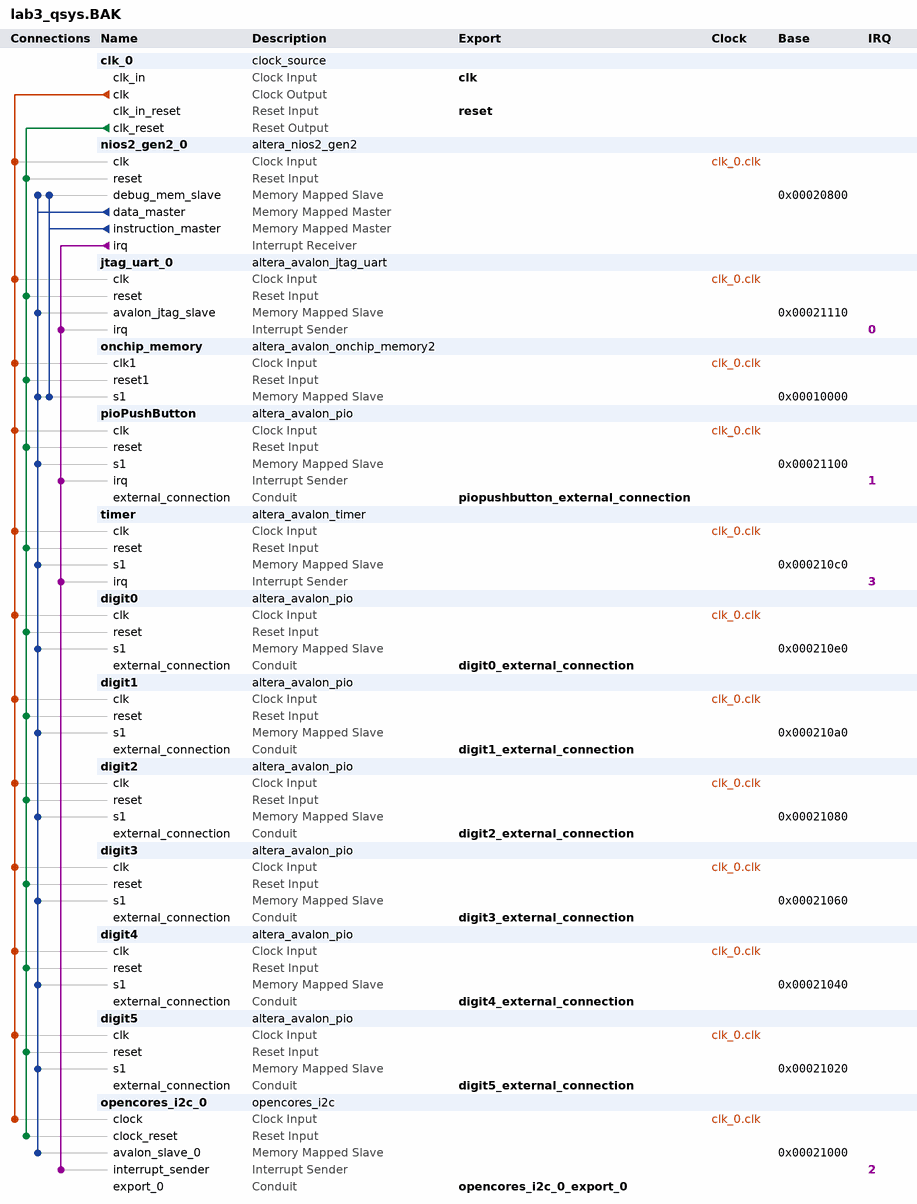
[diagram p0: system contents]
# Platform Designer (Qsys) system lab3_qsys.BAK, MAX 10 10M50DAF484C7G
# Parameters at their usual value, and those the tool derives, are not listed.
package require -exact qsys 18.0
create_system lab3_qsys.BAK
set_project_property DEVICE_FAMILY {MAX 10}
set_project_property DEVICE 10M50DAF484C7G

add_instance clk_0 clock_source 18.0
set_instance_parameter_value clk_0 clockFrequency 50000000

add_instance nios2_gen2_0 altera_nios2_gen2 18.0
set_instance_parameter_value nios2_gen2_0 dcache_size 2048
set_instance_parameter_value nios2_gen2_0 exceptionSlave onchip_memory.s1
set_instance_parameter_value nios2_gen2_0 icache_size 4096
set_instance_parameter_value nios2_gen2_0 impl Tiny
set_instance_parameter_value nios2_gen2_0 resetSlave onchip_memory.s1

add_instance jtag_uart_0 altera_avalon_jtag_uart 18.0
set_instance_parameter_value jtag_uart_0 simInteractiveOptions NO_INTERACTIVE_WINDOWS

add_instance onchip_memory altera_avalon_onchip_memory2 18.0
set_instance_parameter_value onchip_memory dataWidth 32
set_instance_parameter_value onchip_memory dualPort false
set_instance_parameter_value onchip_memory initMemContent false
set_instance_parameter_value onchip_memory initializationFileName {C:/Users/User/Documents/Conception conjointe/FAUGERE_Lab1/software/app/mem_init/lab1_qsys_onchip_memory.hex}
set_instance_parameter_value onchip_memory memorySize 40000

add_instance pioPushButton altera_avalon_pio 18.0
set_instance_parameter_value pioPushButton bitClearingEdgeCapReg true
set_instance_parameter_value pioPushButton captureEdge true
set_instance_parameter_value pioPushButton direction Input
set_instance_parameter_value pioPushButton edgeType FALLING
set_instance_parameter_value pioPushButton generateIRQ true
set_instance_parameter_value pioPushButton irqType EDGE
set_instance_parameter_value pioPushButton width 1

add_instance timer altera_avalon_timer 18.0
set_instance_parameter_value timer period 100
set_instance_parameter_value timer periodUnits MSEC

add_instance digit0 altera_avalon_pio 18.0
set_instance_parameter_value digit0 bitModifyingOutReg true
set_instance_parameter_value digit0 direction Output
set_instance_parameter_value digit0 width 4

add_instance digit1 altera_avalon_pio 18.0
set_instance_parameter_value digit1 bitModifyingOutReg true
set_instance_parameter_value digit1 direction Output
set_instance_parameter_value digit1 width 4

add_instance digit2 altera_avalon_pio 18.0
set_instance_parameter_value digit2 bitModifyingOutReg true
set_instance_parameter_value digit2 direction Output
set_instance_parameter_value digit2 width 4

add_instance digit3 altera_avalon_pio 18.0
set_instance_parameter_value digit3 bitModifyingOutReg true
set_instance_parameter_value digit3 direction Output
set_instance_parameter_value digit3 width 4

add_instance digit4 altera_avalon_pio 18.0
set_instance_parameter_value digit4 bitModifyingOutReg true
set_instance_parameter_value digit4 direction Output
set_instance_parameter_value digit4 width 4

add_instance digit5 altera_avalon_pio 18.0
set_instance_parameter_value digit5 bitModifyingOutReg true
set_instance_parameter_value digit5 direction Output
set_instance_parameter_value digit5 width 4

add_instance opencores_i2c_0 opencores_i2c 9.1

# connections
add_connection clk_0.clk digit0.clk clock
add_connection clk_0.clk digit1.clk clock
add_connection clk_0.clk digit2.clk clock
add_connection clk_0.clk digit3.clk clock
add_connection clk_0.clk digit4.clk clock
add_connection clk_0.clk digit5.clk clock
add_connection clk_0.clk jtag_uart_0.clk clock
add_connection clk_0.clk nios2_gen2_0.clk clock
add_connection clk_0.clk onchip_memory.clk1 clock
add_connection clk_0.clk opencores_i2c_0.clock clock
add_connection clk_0.clk pioPushButton.clk clock
add_connection clk_0.clk timer.clk clock
add_connection clk_0.clk_reset digit0.reset reset
add_connection clk_0.clk_reset digit1.reset reset
add_connection clk_0.clk_reset digit2.reset reset
add_connection clk_0.clk_reset digit3.reset reset
add_connection clk_0.clk_reset digit4.reset reset
add_connection clk_0.clk_reset digit5.reset reset
add_connection clk_0.clk_reset jtag_uart_0.reset reset
add_connection clk_0.clk_reset nios2_gen2_0.reset reset
add_connection clk_0.clk_reset onchip_memory.reset1 reset
add_connection clk_0.clk_reset opencores_i2c_0.clock_reset reset
add_connection clk_0.clk_reset pioPushButton.reset reset
add_connection clk_0.clk_reset timer.reset reset
add_connection nios2_gen2_0.data_master digit0.s1 avalon
set_connection_parameter_value nios2_gen2_0.data_master/digit0.s1 baseAddress 0x000210e0
add_connection nios2_gen2_0.data_master digit1.s1 avalon
set_connection_parameter_value nios2_gen2_0.data_master/digit1.s1 baseAddress 0x000210a0
add_connection nios2_gen2_0.data_master digit2.s1 avalon
set_connection_parameter_value nios2_gen2_0.data_master/digit2.s1 baseAddress 0x00021080
add_connection nios2_gen2_0.data_master digit3.s1 avalon
set_connection_parameter_value nios2_gen2_0.data_master/digit3.s1 baseAddress 0x00021060
add_connection nios2_gen2_0.data_master digit4.s1 avalon
set_connection_parameter_value nios2_gen2_0.data_master/digit4.s1 baseAddress 0x00021040
add_connection nios2_gen2_0.data_master digit5.s1 avalon
set_connection_parameter_value nios2_gen2_0.data_master/digit5.s1 baseAddress 0x00021020
add_connection nios2_gen2_0.data_master jtag_uart_0.avalon_jtag_slave avalon
set_connection_parameter_value nios2_gen2_0.data_master/jtag_uart_0.avalon_jtag_slave baseAddress 0x00021110
add_connection nios2_gen2_0.data_master nios2_gen2_0.debug_mem_slave avalon
set_connection_parameter_value nios2_gen2_0.data_master/nios2_gen2_0.debug_mem_slave baseAddress 0x00020800
add_connection nios2_gen2_0.data_master onchip_memory.s1 avalon
set_connection_parameter_value nios2_gen2_0.data_master/onchip_memory.s1 baseAddress 0x00010000
add_connection nios2_gen2_0.data_master opencores_i2c_0.avalon_slave_0 avalon
set_connection_parameter_value nios2_gen2_0.data_master/opencores_i2c_0.avalon_slave_0 baseAddress 0x00021000
add_connection nios2_gen2_0.data_master pioPushButton.s1 avalon
set_connection_parameter_value nios2_gen2_0.data_master/pioPushButton.s1 baseAddress 0x00021100
add_connection nios2_gen2_0.data_master timer.s1 avalon
set_connection_parameter_value nios2_gen2_0.data_master/timer.s1 baseAddress 0x000210c0
add_connection nios2_gen2_0.instruction_master nios2_gen2_0.debug_mem_slave avalon
set_connection_parameter_value nios2_gen2_0.instruction_master/nios2_gen2_0.debug_mem_slave baseAddress 0x00020800
add_connection nios2_gen2_0.instruction_master onchip_memory.s1 avalon
set_connection_parameter_value nios2_gen2_0.instruction_master/onchip_memory.s1 baseAddress 0x00010000
add_connection nios2_gen2_0.irq jtag_uart_0.irq interrupt
set_connection_parameter_value nios2_gen2_0.irq/jtag_uart_0.irq irqNumber 0
add_connection nios2_gen2_0.irq opencores_i2c_0.interrupt_sender interrupt
set_connection_parameter_value nios2_gen2_0.irq/opencores_i2c_0.interrupt_sender irqNumber 2
add_connection nios2_gen2_0.irq pioPushButton.irq interrupt
set_connection_parameter_value nios2_gen2_0.irq/pioPushButton.irq irqNumber 1
add_connection nios2_gen2_0.irq timer.irq interrupt
set_connection_parameter_value nios2_gen2_0.irq/timer.irq irqNumber 3

# exported interfaces
add_interface clk clock sink
set_interface_property clk EXPORT_OF clk_0.clk_in
add_interface digit0_external_connection conduit end
set_interface_property digit0_external_connection EXPORT_OF digit0.external_connection
add_interface digit1_external_connection conduit end
set_interface_property digit1_external_connection EXPORT_OF digit1.external_connection
add_interface digit2_external_connection conduit end
set_interface_property digit2_external_connection EXPORT_OF digit2.external_connection
add_interface digit3_external_connection conduit end
set_interface_property digit3_external_connection EXPORT_OF digit3.external_connection
add_interface digit4_external_connection conduit end
set_interface_property digit4_external_connection EXPORT_OF digit4.external_connection
add_interface digit5_external_connection conduit end
set_interface_property digit5_external_connection EXPORT_OF digit5.external_connection
add_interface opencores_i2c_0_export_0 conduit end
set_interface_property opencores_i2c_0_export_0 EXPORT_OF opencores_i2c_0.export_0
add_interface piopushbutton_external_connection conduit end
set_interface_property piopushbutton_external_connection EXPORT_OF pioPushButton.external_connection
add_interface reset reset sink
set_interface_property reset EXPORT_OF clk_0.clk_in_reset

set_interconnect_requirement {$system} qsys_mm.clockCrossingAdapter HANDSHAKE
set_interconnect_requirement {$system} qsys_mm.enableEccProtection FALSE
set_interconnect_requirement {$system} qsys_mm.insertDefaultSlave FALSE
set_interconnect_requirement {$system} qsys_mm.maxAdditionalLatency 1

save_system lab3_qsys.BAK.qsys
